# EAGLE schematic 7SegLed (EAGLE 7.5.0)
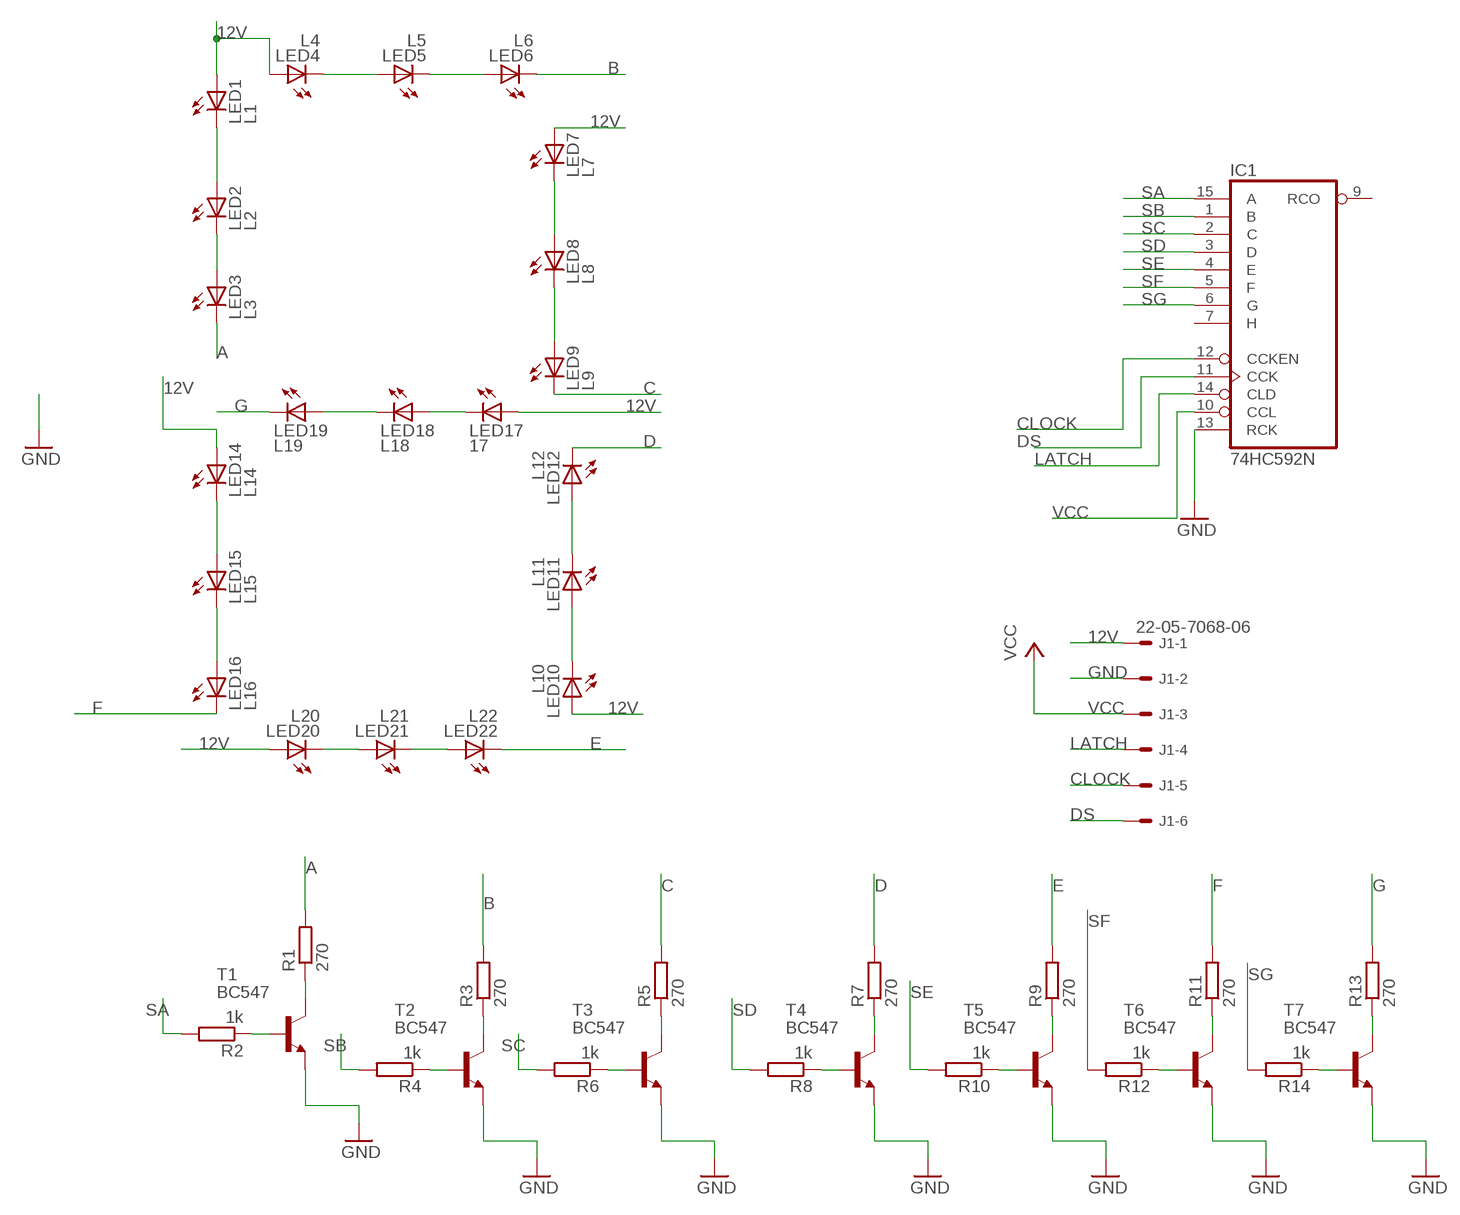
[diagram p0: schematic, sheet 1]

## Parts
IC1  74HC592N  [DIL16]
J1  22-05-7068-06  [7395-06]
LED1  L1  LED5MM  [LED5MM]
LED2  L2  LED5MM  [LED5MM]
LED3  L3  LED5MM  [LED5MM]
LED4  L4  LED5MM  [LED5MM]
LED5  L5  LED5MM  [LED5MM]
LED6  L6  LED5MM  [LED5MM]
LED7  L7  LED5MM  [LED5MM]
LED8  L8  LED5MM  [LED5MM]
LED9  L9  LED5MM  [LED5MM]
LED10  L10  LED5MM  [LED5MM]
LED11  L11  LED5MM  [LED5MM]
LED12  L12  LED5MM  [LED5MM]
LED14  L14  LED5MM  [LED5MM]
LED15  L15  LED5MM  [LED5MM]
LED16  L16  LED5MM  [LED5MM]
LED17  17  LED5MM  [LED5MM]
LED18  L18  LED5MM  [LED5MM]
LED19  L19  LED5MM  [LED5MM]
LED20  L20  LED5MM  [LED5MM]
LED21  L21  LED5MM  [LED5MM]
LED22  L22  LED5MM  [LED5MM]
R1  270  R-EU_0207/10  [0207/10]
R2  1k  R-EU_0207/10  [0207/10]
R3  270  R-EU_0207/10  [0207/10]
R4  1k  R-EU_0207/10  [0207/10]
R5  270  R-EU_0207/10  [0207/10]
R6  1k  R-EU_0207/10  [0207/10]
R7  270  R-EU_0207/10  [0207/10]
R8  1k  R-EU_0207/10  [0207/10]
R9  270  R-EU_0207/10  [0207/10]
R10  1k  R-EU_0207/10  [0207/10]
R11  270  R-EU_0207/10  [0207/10]
R12  1k  R-EU_0207/10  [0207/10]
R13  270  R-EU_0207/10  [0207/10]
R14  1k  R-EU_0207/10  [0207/10]
T1  BC547  [TO92]
T2  BC547  [TO92]
T3  BC547  [TO92]
T4  BC547  [TO92]
T5  BC547  [TO92]
T6  BC547  [TO92]
T7  BC547  [TO92]

## Nets
12V: J1.1 LED1.A LED4.A LED7.A LED10.A LED14.A LED17.A LED20.A
A: LED3.K(C) R1.2
B: LED6.K(C) R3.2
C: LED9.K(C) R5.2
CLOCK: IC1.12(CCKEN) J1.5
D: LED12.K(C) R7.2
DS: IC1.11(CCK) J1.6
E: LED22.K(C) R9.2
F: LED16.K(C) R11.2
G: LED19.K(C) R13.2
GND: IC1.13(RCK) J1.2 T1.1(E) T2.1(E) T3.1(E) T4.1(E) T5.1(E) T6.1(E) T7.1(E)
LATCH: IC1.14(CLD) J1.4
N$1: LED4.K(C) LED5.A
N$2: LED5.K(C) LED6.A
N$3: LED7.K(C) LED8.A
N$4: LED8.K(C) LED9.A
N$5: LED10.K(C) LED11.A
N$6: LED11.K(C) LED12.A
N$7: LED21.K(C) LED22.A
N$8: LED20.K(C) LED21.A
N$9: LED15.K(C) LED16.A
N$10: LED14.K(C) LED15.A
N$11: LED1.K(C) LED2.A
N$12: LED2.K(C) LED3.A
N$13: LED17.K(C) LED18.A
N$14: LED18.K(C) LED19.A
N$15: R3.1 T2.3(C)
N$16: R4.1 T2.2(B)
N$17: R5.1 T3.3(C)
N$18: R6.1 T3.2(B)
N$19: R7.1 T4.3(C)
N$20: R8.1 T4.2(B)
N$21: R9.1 T5.3(C)
N$22: R10.1 T5.2(B)
N$23: R1.1 T1.3(C)
N$24: R2.1 T1.2(B)
N$25: R11.1 T6.3(C)
N$26: R12.1 T6.2(B)
N$27: R13.1 T7.3(C)
N$28: R14.1 T7.2(B)
SA: IC1.15(A) R2.2
SB: IC1.1(B) R4.2
SC: IC1.2(C) R6.2
SD: IC1.3(D) R8.2
SE: IC1.4(E) R10.2
SF: IC1.5(F) R12.2
SG: IC1.6(G) R14.2
VCC: IC1.10(CCL) J1.3
Unconnected: IC1.7(H) IC1.9(RCO)

## Power pins joined to a net without a drawn wire
GND: IC1.8(GND)
VCC: IC1.16(VCC)

## Library data of the parts
IC1 = 74xx-eu:74*592: 8-bit binary COUNTER, input register
J1 = con-molex:22-?-06: CONNECTOR wire to board 2.54 mm (.1 inch) pitch header; OC_FARNELL: unknown; OC_NEWARK: unknown
LED1-LED12 LED14-LED22 = led:LED: LED OSRAM: - CHIPLED LG R971, LG N971, LY N971, LG Q971, LY Q971, LO R971, LY R971 LH N974, LH R974 LS Q976, LO Q976, LY Q976 LO Q996 - Hyper CHIPLED LW Q18S LB Q993, LB Q99A, LB R99A - SideLED LS A670, LO A670, LY A670, LG A670, LP A670 LB A673, LV A673, LT A673, LW A673 LH A674 LY A675 LS A676, LA A676, LO A676, LY A676, LW A676 LS A679, LY A679, LG A679 - Hyper Micro SIDELED® LS Y876, LA Y876, LO Y876, LY Y876 LT Y87S - SmartLED LW L88C, LW L88S LB L89C, LB L89S, LG L890 LS L89K, LO L89K, LY L89K LS L896, LA L896, LO L896, LY L896 - TOPLED LS T670, LO T670, LY T670, LG T670, LP T670 LSG T670, LSP T670, LSY T670, LOP T670, LYG T670 LG T671, LOG T671, LSG T671 LB T673, LV T673, LT T673, LW T673 LH T674 LS T676, LA T676, LO T676, LY T676, LB T676, LH T676, LSB T676, LW T676 LB T67C, LV T67C, LT T67C, LS T67K, LO T67K, LY T67K, LW E67C LS E67B, LA E67B, LO E67B, LY E67B, LB E67C, LV E67C, LT E67C LW T67C LS T679, LY T679, LG T679 LS T770, LO T770, LY T770, LG T770, LP T770 LB T773, LV T773, LT T773, LW T773 LH T774 LS E675, LA E675, LY E675, LS T675 LS T776, LA T776, LO T776, LY T776, LB T776 LHGB T686 LT T68C, LB T68C - Hyper Mini TOPLED® LB M676 - Mini TOPLED Santana® LG M470 LS M47K, LO M47K, LY M47K Source: http://www.osram.convergy.de LUXEON: - LUMILED® LXK2-PW12-R00, LXK2-PW12-S00, LXK2-PW14-U00, LXK2-PW14-V00 LXK2-PM12-R00, LXK2-PM12-S00, LXK2-PM14-U00 LXK2-PE12-Q00, LXK2-PE12-R00, LXK2-PE12-S00, LXK2-PE14-T00, LXK2-PE14-U00 LXK2-PB12-K00, LXK2-PB12-L00, LXK2-PB12-M00, LXK2-PB14-N00, LXK2-PB14-P00, LXK2-PB14-Q00 LXK2-PR12-L00, LXK2-PR12-M00, LXK2-PR14-Q00, LXK2-PR14-R00 LXK2-PD12-Q00, LXK2-PD12-R00, LXK2-PD12-S00 LXK2-PH12-R00, LXK2-PH12-S00 LXK2-PL12-P00, LXK2-PL12-Q00, LXK2-PL12-R00 Source: www.luxeon.com KINGBRIGHT: KA-3528ASYC Source: www.kingbright.com
R1-R14 = resistor:R-EU_: RESISTOR, European symbol
T1-T7 = transistor:BC547: NPN TRANSISTOR